# Altium schematic sheet Relay.SchDoc
size A4; SheetNumber: 4; SheetTotal: 5
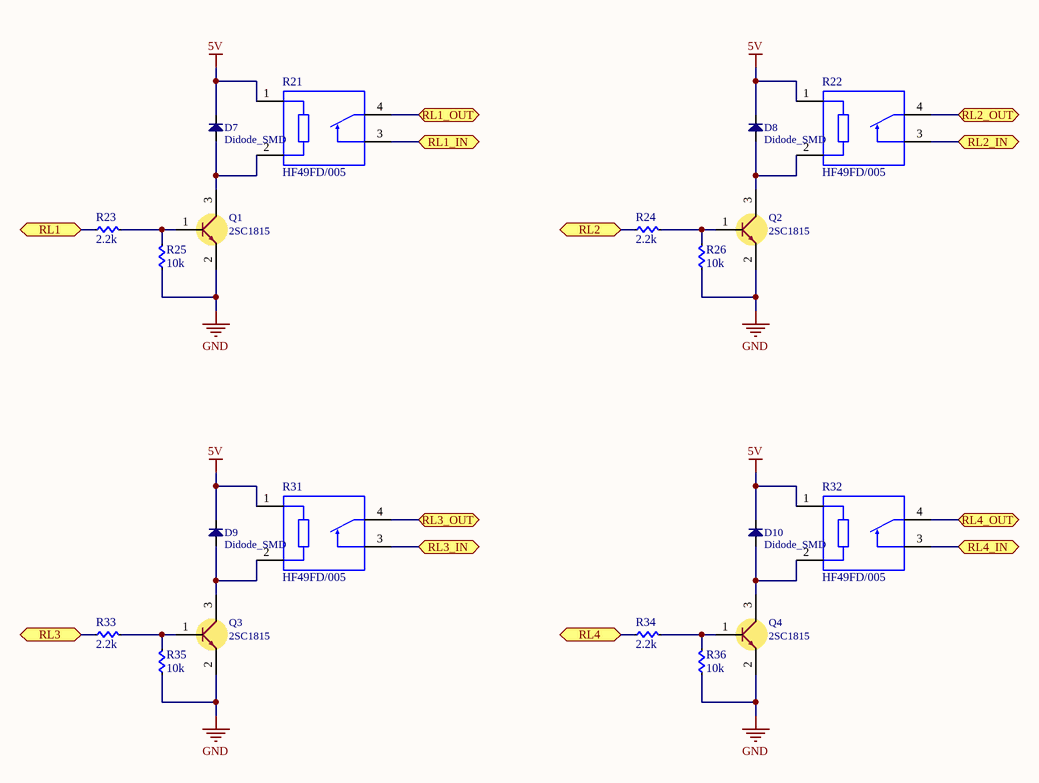
[diagram p0: Relay.SchDoc]

## Parts
D7  Didode_SMD  [SOD-123]
D8  Didode_SMD  [SOD-123]
D9  Didode_SMD  [SOD-123]
D10  Didode_SMD  [SOD-123]
Q1  2SC1815  [SOT23]
Q2  2SC1815  [SOT23]
Q3  2SC1815  [SOT23]
Q4  2SC1815  [SOT23]
R21  HF49FD/005  [RELAY_HF49FD/005-1H12T]
R22  HF49FD/005  [RELAY_HF49FD/005-1H12T]
R23  2.2k  [RES 0603]
R24  2.2k  [RES 0603]
R25  10k  [RES 0603]
R26  10k  [RES 0603]
R31  HF49FD/005  [RELAY_HF49FD/005-1H12T]
R32  HF49FD/005  [RELAY_HF49FD/005-1H12T]
R33  2.2k  [RES 0603]
R34  2.2k  [RES 0603]
R35  10k  [RES 0603]
R36  10k  [RES 0603]

## Ports
RL1 (bidir), RL1_IN (bidir), RL1_OUT (bidir), RL2 (bidir), RL2_IN (bidir), RL2_OUT (bidir), RL3 (bidir), RL3_IN (bidir), RL3_OUT (bidir), RL4 (bidir), RL4_IN (bidir), RL4_OUT (bidir)

## Nets
5V: D7.2(K) D8.2(K) D9.2(K) D10.2(K) R21.1(L1) R22.1(L1) R31.1(L1) R32.1(L1)
GND: Q1.2(E) Q2.2(E) Q3.2(E) Q4.2(E) R25.1 R26.1 R35.1 R36.1
RL1: R23.1 ; port RL1
RL1_IN: R21.3(C2) ; port RL1_IN
RL1_OUT: R21.4(C1) ; port RL1_OUT
RL2: R24.1 ; port RL2
RL2_IN: R22.3(C2) ; port RL2_IN
RL2_OUT: R22.4(C1) ; port RL2_OUT
RL3: R33.1 ; port RL3
RL3_IN: R31.3(C2) ; port RL3_IN
RL3_OUT: R31.4(C1) ; port RL3_OUT
RL4: R34.1 ; port RL4
RL4_IN: R32.3(C2) ; port RL4_IN
RL4_OUT: R32.4(C1) ; port RL4_OUT
NetD7_1: D7.1(A) Q1.3(C) R21.2(L2)
NetD8_1: D8.1(A) Q2.3(C) R22.2(L2)
NetD9_1: D9.1(A) Q3.3(C) R31.2(L2)
NetD10_1: D10.1(A) Q4.3(C) R32.2(L2)
NetQ1_1: Q1.1(B) R23.2 R25.2
NetQ2_1: Q2.1(B) R24.2 R26.2
NetQ3_1: Q3.1(B) R33.2 R35.2
NetQ4_1: Q4.1(B) R34.2 R36.2

## Library data of the parts
D7-D10 = Didode_SMD: Vendor: Digikey; Value: FR307; Current: 3Amp; Published: 8-Jun-2000; LatestRevisionDate: 17-Jul-2002; LatestRevisionNote: Re-released for DXP Platform.; DatasheetDocument: 1997; PackageReference: DO-35; Publisher: Altium Limited; Code_JEDEC: DO-204-AH; ComponentLink1Description: Digikey Part Link; ComponentLink1URL: http://www.fairchildsemi.com/; ComponentLink2Description: Open Datasheet; ComponentLink2URL: H:\LIBRARY\LIBRARY.Datasheet\ds26003.pdf
Q1-Q4 = NPN_SMD: SMD TRANSISTOR
R21 R22 R31 R32 = Relay HF49FD: Relay: electromagnetic; SPST-NO; Ucoil: 5VDC; 5A/250VAC; 5A/30VDC
R23 R24 R33 R34 = RES 0603: RES SMD 0603; Manufacturer: Vishay Dale; Manufacturer Part Number: CRCW040210K0FKED; Resistance (Ohms): 10k; Tolerance: ±1%; Power (Watts): 0.063W, 1/16W; Temperature Coefficient: ±100ppm/°C; Supplier 1: Digi-Key; RoHS: RoHS Compliant; Category: Resistors; Stock 1: 2392462; Pricing 1: 10=0.083, 50=0.0444, 200=0.0255, 1000=0.0174 (USD); Packaging: Cut Tape (CT); Composition: Thick Film; Features: Automotive AEC-Q200; Operating Temperature: -55°C ~ 155°C; Package / Case: 0402 (1005 Metric); Supplier Device Package: 0402 (1005 Metric); Size / Dimension: 0.039" L x 0.020" W (1.00mm x 0.50mm); Height: 0.016" (0.40mm); Number of Terminations: 2; ComponentLink1URL: http://www.vishay.com/docs/20035/dcrcwe3.pdf; ComponentLink1Description: http://www.vishay.com/docs/20035/dcrcwe3.pdf; Supplier Part Number 1: 541-10.0KLCT-ND
R25 R26 R35 R36 = RES 0603: RES SMD 0603; Manufacturer: Vishay Dale; Manufacturer Part Number: CRCW040210K0FKED; Tolerance: ±1%; Power (Watts): 0.063W, 1/16W; Temperature Coefficient: ±100ppm/°C; Supplier 1: Digi-Key; RoHS: RoHS Compliant; Category: Resistors; Stock 1: 2392462; Pricing 1: 10=0.083, 50=0.0444, 200=0.0255, 1000=0.0174 (USD); Packaging: Cut Tape (CT); Resistance (Ohms): 10k; Composition: Thick Film; Features: Automotive AEC-Q200; Operating Temperature: -55°C ~ 155°C; Package / Case: 0402 (1005 Metric); Supplier Device Package: 0402 (1005 Metric); Size / Dimension: 0.039" L x 0.020" W (1.00mm x 0.50mm); Height: 0.016" (0.40mm); Number of Terminations: 2; ComponentLink1URL: http://www.vishay.com/docs/20035/dcrcwe3.pdf; ComponentLink1Description: http://www.vishay.com/docs/20035/dcrcwe3.pdf; Supplier Part Number 1: 541-10.0KLCT-ND